# Altium schematic sheet Audio_Amplifier.SchDoc
size A4; SheetNumber: 1; SheetTotal: 1
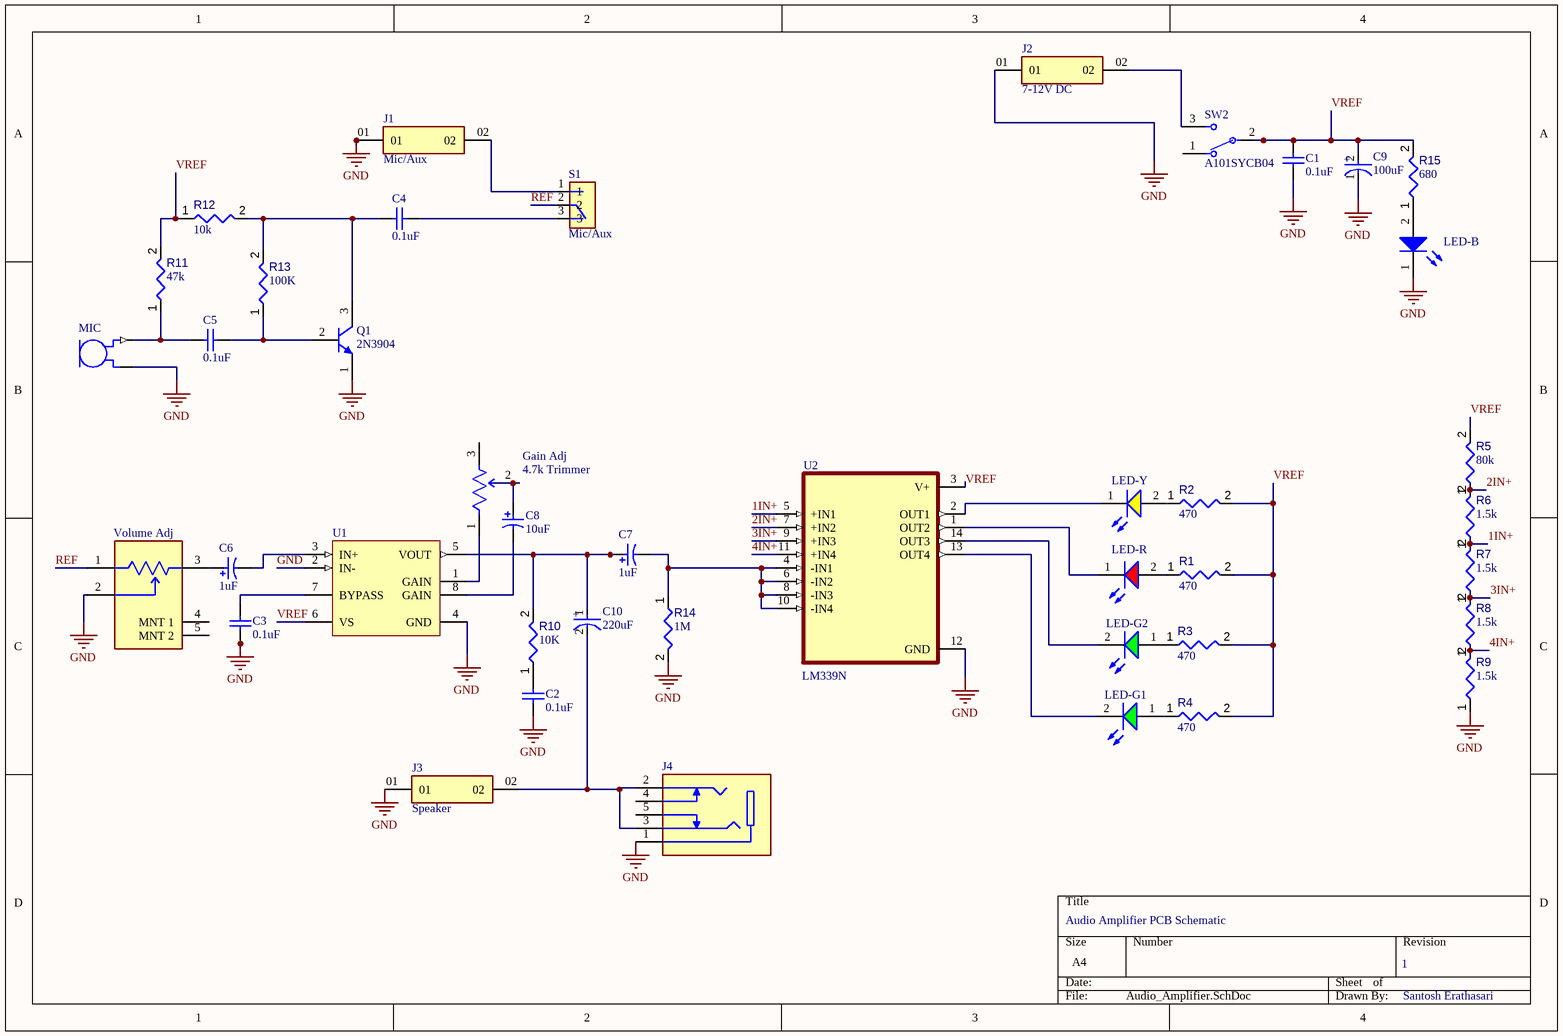
[diagram p0: Audio_Amplifier.SchDoc]

## Parts
C1  0.1uF  [CAPR51-254-508X318X736]
C2  0.1uF  [CAPR51-254-508X318X736]
C3  0.1uF  [CAPR51-254-508X318X736]
C4  0.1uF  [CAPR51-254-508X318X736]
C5  0.1uF  [CAPR51-254-508X318X736]
C6  1uF  [CAPPR55-200-1100X500X1200]
C7  1uF  [CAPPR55-200-1100X500X1200]
C8  10uF  [CAPPR55-200-1100X500X1200]
C9  100uF  [FP-RAD-TH-D_6_3_0_5-L_11-MFG]
C10  220uF  [FP-EEU-FC1V221L-MFG]
Gain_Adj  4.7k Trimmer  [FP-3362U-MFG]
J1  Mic/Aux  [SAMTEC_HTSW-101-08-T-D]
J2  7-12V DC  [SAMTEC_HTSW-101-08-T-D]
J3  Speaker  [SAMTEC_HTSW-101-08-T-D]
J4  SJ1-3525NG  [CUI_SJ1-3525NG]  (value not drawn)
LED-B  LED-B  [WL-TMRW_D5.8H11.7]  (value not drawn)
LED-G1  151051VS04000  [WL-TMRC_D5.9H8.7]  (value not drawn)
LED-G2  151051VS04000  [WL-TMRC_D5.9H8.7]  (value not drawn)
LED-R  151053RS03000  [WL-TMRW_D5.8H11.7]  (value not drawn)
LED-Y  LED-Y  [WL-TMRW_D5.8H11.7]  (value not drawn)
MIC  CMA-6542PF  [CUI_CMA-6542PF]  (value not drawn)
Q1  2N3904  [ONSC-TO-92-3-29-11]
R1  value 470  [RESA60-630X240]  (hidden comment: MFR-25FBF52-10K)
R2  value 470  [RESA60-630X240]  (hidden comment: MFR-25FBF52-10K)
R3  value 470  [RESA60-630X240]  (hidden comment: MFR-25FBF52-10K)
R4  value 470  [RESA60-630X240]  (hidden comment: MFR-25FBF52-10K)
R5  value 80k  [RESA60-630X240]  (hidden comment: MFR-25FBF52-10K)
R6  value 1.5k  [RESA60-630X240]  (hidden comment: MFR-25FBF52-10K)
R7  value 1.5k  [RESA60-630X240]  (hidden comment: MFR-25FBF52-10K)
R8  value 1.5k  [RESA60-630X240]  (hidden comment: MFR-25FBF52-10K)
R9  value 1.5k  [RESA60-630X240]  (hidden comment: MFR-25FBF52-10K)
R10  value 10K  [RESA60-630X240]  (hidden comment: MFR-25FBF52-10K)
R11  value 47k  [RESA60-630X240]  (hidden comment: MFR-25FBF52-10K)
R12  value 10k  [RESA60-630X240]  (hidden comment: MFR-25FBF52-10K)
R13  value 100K  [RESA60-630X240]  (hidden comment: MFR-25FBF52-10K)
R14  value 1M  [RESA60-630X240]  (hidden comment: MFR-25FBF52-10K)
R15  value 680  [RESA60-630X240]  (hidden comment: MFR-25FBF52-10K)
S1  Mic/Aux  [SW_OS102011MS2QN1]
SW2  A101SYCB04  [FP-A101SYCB04-MFG]
U1  LM386N-1  [P0008A]  (value not drawn)
U2  LM339N  [DIP794W45P254L1969H508Q14]
Volume_Adj  PTV09A-8025U-B103  [FP-PTV09-8-MFG]  (value not drawn)

## Nets
GND: C1.2 C2.1 C3.1 C9.1(C) J1.01 J2.01 J3.01 J4.1 LED-B.1(K) MIC.GND Q1.1(E) R9.1 R14.2 U1.2(IN-) U1.4(GND) U2.12(GND) Volume_Adj.2
1IN+: R6.1 R7.2 U2.5(+IN1)
2IN+: R5.1 R6.2 U2.7(+IN2)
3IN+: R7.1 R8.2 U2.9(+IN3)
4IN+: R8.1 R9.2 U2.11(+IN4)
REF: S1.2 Volume_Adj.1
VREF: C1.1 C9.2(A) R1.2 R2.2 R3.2 R4.2 R5.2 R11.2 R12.1 R15.2 SW2.2 U1.6(VS) U2.3(V+)
NetC2_2: C2.2 R10.1
NetC3_2: C3.2 U1.7(BYPASS)
NetC4_1: C4.1 Q1.3(C) R12.2 R13.2
NetC4_2: C4.2 S1.3
NetC5_1: C5.1 MIC.OUT R11.1
NetC5_2: C5.2 Q1.2(B) R13.1
NetC6_1: C6.1 Volume_Adj.3
NetC6_2: C6.2 U1.3(IN+)
NetC7_1: C7.1 C10.1(C) R10.2 U1.5(VOUT)
NetC7_2: C7.2 R14.1 U2.4(-IN1) U2.6(-IN2) U2.8(-IN3) U2.10(-IN4)
NetC8_1: C8.1 Gain_Adj.2(WIPER)
NetC8_2: C8.2 U1.8(GAIN)
NetC10_2: C10.2(A) J3.02 J4.2 J4.3
NetGain_Adj_1: Gain_Adj.1(CCW) U1.1(GAIN)
NetJ1_02: J1.02 S1.1
NetJ2_02: J2.02 SW2.3
NetLED-B_2: LED-B.2(A) R15.1
NetLED-G1_1: LED-G1.1(A) R4.1
NetLED-G1_2: LED-G1.2(K) U2.13(OUT4)
NetLED-G2_1: LED-G2.1(A) R3.1
NetLED-G2_2: LED-G2.2(K) U2.14(OUT3)
NetLED-R_1: LED-R.1(K) U2.1(OUT2)
NetLED-R_2: LED-R.2(A) R1.1
NetLED-Y_1: LED-Y.1(K) U2.2(OUT1)
NetLED-Y_2: LED-Y.2(A) R2.1

Not connected (* = marked no-connect by the designer): Gain_Adj 3(CW); J4 4 5; SW2 1; Volume_Adj 4(MNT_1) 5(MNT_2)

## Notes on the sheet
- Audio Amplifier PCB Schematic
- 1
- Santosh Erathasari
- (in symbol CMP-05427-000010-1) +
- (in symbol CMP-05427-001480-1) +

## Library data of the parts
C1-C5 = CMP-1664-00004-1: Radial Leaded Multilayer Ceramic Capacitor, 0.1 uF, +/- 10%, 50 V, -55 to 125 degC, 2-Pin THD, RoHS, Tape and Reel; Case\Package: SOT-23-5; Max Power Dissipation: 250 mW; Output Current: 150 mA; Dropout Voltage: 260 mV; Outputs: 1; Output Voltage: 5 V; Max Input Voltage: 8 V; Min Operating Temperature: -40 degC; Packaging: Tape and Reel; Height: 1.3 mm; Radiation Hardening: No; Pins: 5; ComponentLink1Description: Manufacturer URL; Mount: Surface Mount; RoHSCompliant: true; Max Operating Temperature: 85 degC; PackageReference: CAPR51-254-508X318X736; ComponentLink2URL: http://www.kemet.com/docfinder?Partnumber=C320C104K5R5TA; PackageDescription: 2-Pin Through Hole Device, Body 5.08 x 3.18 mm, Pitch 2.54 mm; ComponentLink1URL: http://www.kemet.com/; Width: 1.8 mm; Package Quantity: 3000; DatasheetVersion: Dec-15; Length: 3 mm; ComponentLink2Description: Datasheet
C6 C7 = CMP-1665-00039-1: Aluminum Electrolytic Capacitor, 1 uF, +/- 20%, 50 V, -55 to 105 degC, 2-Pin THD, RoHS, Bulk; Channels: 2; ComponentLink1Description: Manufacturer URL; ComponentLink2Description: Datasheet; ComponentLink2URL: https://datasheet.ciiva.com/7275/94060-7275472.pdf; PackageDescription: 2-Pin Radial Lead, Dia 5 mm, Body Length 11 mm; PackageReference: CAPPR55-200-1100X500X1200; Mount: Through Hole; Radiation Hardening: No; ComponentLink1URL: http://www.panasonic.com/; Min Operating Temperature: -30 degC; Package Quantity: 150; Max Operating Temperature: 70 degC; DatasheetVersion: Mar-05; RoHSCompliant: true; Packaging: Bulk
C8 = CMP-1665-00038-2: Aluminum Electrolytic Capacitor, 10 uF, +/- 20%, 50 V, -40 to 85 degC, 2-Pin THD, RoHS, Bulk; Manufacturer: Panasonic; Life (Hours): 2000Hour; Lead/Base Style: Straight; Dissipation Factor: 0.12%; Leakage Current: 3uA; Dielectric Material: Aluminium; Lead Diameter: 0.5mm; Voltage Rating: 50V; Ripple Current: 65mA; Package Reference: CAPPR55-200-1100X500X1200; Height: 11mm; Diameter: 5mm; REACH SVHC: NoSVHC; Mount: ThroughHole; Packaging: Bulk; Manufacturer URL: http://www.panasonic.com/; Capacitance: 10uF; Termination: Radial; Datasheet URL: https://industrial.panasonic.com/cdbs/www-data/pdf/RDF0000/ABA0000C1218.pdf; Lead Free: LeadFree; Height - Seated (Max): 0.472inch; Case/Package: Radial; Package Description: 2-Pin Radial Lead, Dia 5 mm, Height 12 mm; Tolerance: 20%; Datasheet Version: Rev. 05, 10/2016; Package Quantity: 200; Ripple Current (AC): 65mA; Min Operating Temperature: -40degC; RoHSCompliant: true; Number of Pins: 2; Max Operating Temperature: 85degC; Voltage: 50V; Lead Pitch: 2mm; Radiation Hardening: No; Voltage Rating (DC): 50V; Length: 11mm
C9 = CMP-05427-001480-1: Aluminum Electrolytic Capacitors (Radial Lead Type) 100uF ±20% 25V
C10 = CMP-05427-000010-1: CAP ALUM 220UF 20% 35V RADIAL; Manufacturer: Panasonic Electronic Components; Manufacturer Part Number: EEU-FC1V221L; Material: Aluminum; Leakage Current: 77uA; Esr: 0.085Ω; Life: 2000Hours; Automotive Grade: Grade 2; Dissipation Factor: 12%; Ripple Current: 730mA; Octopart: https://octopart.com/eeu-fc1v221l-panasonic-39478519; ComponentLink2URL: https://industrial.panasonic.com/cdbs/www-data/pdf/RDF0000/ABA0000C1209.pdf; Package: 0; Height: 16.5mm; Category: Cap; Value: 220uF; ComponentLink2Description: Datasheet; Lead Free: Yes; Device Class L2: Capacitors; Temperature Range High: +105°C; Mouser Description: Capacitor; Aluminum Electrolytic; Fc Radial Elec Cap 220uF 35V; Temperature: -55°C to +105°C; Digikey Description: CAP ALUM 220UF 20% 35V RADIAL; Device Class L3: Aluminum Electrolytic Capacitors; Device Class L1: Passive Components; Automotive: Yes; RoHS: TRUE; Temperature Range Low: -55°C; Capacitance: 220uF; Voltage Rating: 35V; Tolerance: 20%
Gain_Adj = CMP-07234-000033-1: TRIMMER 200K OHM 0.5W PC PIN TOP; Max Power Dissipation: 500mW; Temperature Coefficient: 100ppm/°C; Tolerance: 10%; Voltage Rating (DC): 300V; Resistance: 200kR; Package Quantity: 50; Length: 6.6mm; Lead Free: Lead Free; Technology: CERMET; RoHS Compliant: Yes; Max Operating Temperature: 125°C; Military Standard: Not; Packaging: Rail/Tube; Depth: 6.99mm; Mount: Through Hole; Termination: Pin; Color: Blue; Width: 0.26inch; Height: 0.185inch; Taper: Linear; Min Operating Temperature: -55°C; Weight: 0.02oz; Power Rating: 500mW; Series: Trimpot® 3362 - Sealed; Contact Plating: Tin; Resistor Type: Cermet
J1-J3 = HTSW-101-08-T-D: MP: HTSW-101-08-T-D; Price: None; Package: None; Value: *; Availability: Unavailable
J4 = CMP-002-00071-1: 3.5 mm Right-Angle Stereo Jack, 5 Pin PCB Mount, Isolated Ground; Price: None; Value: *; Case/Package: None; MP: SJ1-3525NG; Design Item ID: SJ1-3525NG; Source: SJ1-3525NG.SchLib; Availability: Unavailable
LED-B = CMP-1489-00006-2: NexarPartId: 29717816; Peak Wavelength: 461nm; Luminous Intensity: 2cd; Dominant Wavelength: 465nm; Test Current: 20mA; Lens Style: Circular, Clear, Round; Forward Voltage: 2.7V; Forward Current: 100mA; Viewing Angle: 45°; Lens Size: 5mm; Max Reverse Voltage (DC): 5V; Max Operating Temperature: 85°C; Wavelength: 465nm; REACH SVHC: Unknown; Height: 8.6mm; Min Operating Temperature: -40°C; Width: 5mm; RoHS: Compliant; Mount: Through Hole; Length: 5mm; Case/Package: Radial; Packaging: Bulk; Color: Blue
LED-G1 LED-G2 = CMP-1488-00007-2: NexarPartId: 29717814; Forward Voltage: 2.1V; Viewing Angle: 40°; Lens Size: 5mm; Luminous Intensity: 140mcd; Max Reverse Voltage (DC): 5V; Wavelength: 572nm; Forward Current: 100mA; Peak Wavelength: 573nm; Test Current: 20mA; Lens Style: Circular, Diffused, Round; Color: Green; REACH SVHC: Unknown; Height: 8.6mm; Mount: Through Hole; Width: 5mm; Length: 5mm; Min Operating Temperature: -40°C; RoHS: Compliant; Dominant Wavelength: 572nm; Case/Package: Radial; Max Operating Temperature: 85°C; Packaging: Bulk
LED-R = CMP-1489-00007-2: NexarPartId: 29717818; Viewing Angle: 30°; Test Current: 20mA; Forward Voltage: 1.9V; Lens Size: 5mm; Wavelength: 623nm; Lens Style: Circular, Clear, Round; Luminous Intensity: 5cd; Peak Wavelength: 631nm; Max Reverse Voltage (DC): 5V; Forward Current: 100mA; Height: 8.6mm; Packaging: Bulk; Length: 5mm; Dominant Wavelength: 623nm; RoHS: Compliant; Mount: Through Hole; Max Operating Temperature: 85°C; Width: 5mm; Case/Package: Radial; Min Operating Temperature: -40°C; REACH SVHC: Unknown; Color: Red
LED-Y = CMP-1477-00001-2: NexarPartId: 29717819; Peak Wavelength: 592nm; Dominant Wavelength: 590nm; Viewing Angle: 45°; Luminous Intensity: 1.5cd; Lens Style: Circular, Clear, Round; Forward Current: 100mA; Lens Size: 5mm; Test Current: 20mA; Forward Voltage: 2.1V; Max Reverse Voltage (DC): 5V; REACH SVHC: Unknown; Max Operating Temperature: 85°C; Packaging: Bulk; Case/Package: Radial; Length: 5mm; Width: 5mm; Color: Yellow; Mount: Through Hole; Min Operating Temperature: -40°C; Height: 8.6mm; RoHS: Compliant; Wavelength: 590nm
MIC = CMP-011-000000-1: 9.7 mm, Omnidirectional, PCB Mount, 4.5 Vdc, Electret Condenser Microphone; MF: CUI Devices; Purchase-URL: https://pricing.snapeda.com/search/part/CMA-6542PF/?ref=eda; Check_prices: https://www.snapeda.com/parts/CMA-6542PF/CUI+Devices/view-part/?ref=eda; Pin Count: 2; Source: CMA-6542PF.SchLib; Design Item ID: CMA-6542PF; Value: *; CUI_purchase_URL: https://www.cuidevices.com/product/audio/microphones/electret-condenser-microphones/cma-6542pf?utm_source=snapeda.com&utm_medium=referral&utm_campaign=snapedaBOM; Price: None; Availability: In Stock; Package: None; MP: CMA-6542PF; SnapEDA_Link: https://www.snapeda.com/parts/CMA-6542PF/CUI+Devices/view-part/?ref=snap; Component Type: Standard
Q1 = CMP-2000-05562-1: General Purpose Transistor, NPN Silicon, 200 mA, 60 V, -55 to 150 degC, 3-Pin TO-92, RoHS, Bulk; Manufacturer: ONSemiconductor; Emitter- Base Voltage VEBO: 6V; Maximum Power Dissipation: 625mW; Maximum DC Collector Current: 0.2A; Collector- Emitter Voltage VCEO Max: 40V; Collector- Base Voltage VCBO: 60V; DC Collector/Base Gain hfe Min: 60; Configuration: Single; Collector-Emitter Saturation Voltage: 0.3V; Gain Bandwidth Product fT: 270MHz; Mounting Style: ThroughHole; Package / Case: TO-92-3(TO-226); Mounting Technology: ThroughHole; Minimum Operating Temperature: -65C; Datasheet Version: Rev. 8, 08/2012; Product Category: BipolarTransistors-BJT; Factory Pack Quantity: 5000; Transistor Polarity: NPN; Package Description: 3-Pin Transistor Outline, Body 4.825 x 3.685 mm, Pitch 1.27 mm; RoHS: Details; Datasheet URL: https://datasheet.ciiva.com/4725/2n3903-d-285841-4725808.pdf; Packaging: Bulk; Maximum Operating Temperature: +150C; Package Reference: TO-92-3-29-11; Brand: ONSemiconductor; Manufacturer URL: http://www.onsemi.com/
R1-R15 = CMP-009-00047-4: Axial Resistor, 10 KOhm, +/- 1%, 0.25 W, -55 to 155 degC, 2-Pin THD, RoHS, Bulk; Manufacturer: Yageo; Power: 250mW; Voltage Rating: 250V; Manufacturer URL: http://www.yageo.com/; Datasheet URL: http://www.yageo.com/documents/recent/Yageo%20LR_MFR_2013.pdf; Package Reference: MFR-25; Min Operating Temperature: -55°C; Mounting Technology: TH; Package Quantity: 200; Case/Package: Axial; Tolerance: 1%; RoHS Compliant: True; Datasheet Version: Apr-13; Packaging: Bulk; Max Operating Temperature: 155°C; Package Description: 2-Pin Axial Lead, Dia 2.4 mm, Body Length 6.3 mm
S1 = OS102011MS2QN1: SLIDE SWITCH SPDT T/H ON-ON BBM; MF: C&K; SnapEDA_Link: https://www.snapeda.com/parts/OS102011MS2QN1/C%2526K/view-part/?ref=snap; Purchase-URL: https://pricing.snapeda.com/search/part/OS102011MS2QN1/?ref=eda; MP: OS102011MS2QN1; Value: *; Digi-Key_Part_Number: CKN9565-ND; Check_prices: https://www.snapeda.com/parts/OS102011MS2QN1/C%2526K/view-part/?ref=eda; Package: None
SW2 = CMP-03408-000017-1: SWITCH TOGGLE SPDT 0.4VA 20V; Electrical Life: 6000Cycles; Number of Poles: 1; Power Rating: 400mW; Switch Function: On-On; Contact Resistance: 10mR; Contact Current Rating: 400mA; Actuator Material: Phenolic; Insulation Resistance: 30MR; Actuator Color: Chrome; Number of Positions: 2; Actuator Type: Standard Round; Actuator Length: 10.41mm; Illumination Type: Non-Illuminated; Flammability Rating: UL94 V-1; Contact Material: Copper; Depth: 6.86mm; Contact Plating: Gold; Voltage Rating (AC): 20V; Max Voltage Rating (DC): 20V; Min Operating Temperature: -30°C; Max Operating Temperature: 85°C; Throw Configuration: SPDT; Packaging: Bulk; Termination: PC Pins; Series: Gemini A; ELV: Compliant; Lead Free: Lead Free; RoHS Compliant: Yes; REACH SVHC: No SVHC; Mount: Panel; Orientation: Straight; Package Quantity: 100; Max Voltage Rating (AC): 20V; Radiation Hardening: No; Voltage Rating (DC): 20V
U1 = CMP-0057-00052-4: Low Voltage Audio Power Amplifier, 8-pin MDIP, Pb-Free; Manufacturer: Texas Instruments; PackageTopMarking: NSUZXYTTE#*LM*386N-1; PowerWise: N; CompType: Audio IC; RoHS: Y; PackageReference: P0008A; Code_JEDEC: MS-001-BA; PackageDescription: MDIP, .365 x .250 x .130in, 8 Lead, .100in Pitch; PinCount: 8; ComponentLink1URL: http://www.ti.com/general/docs/lit/getliterature.tsp?genericPartNumber=LM386&fileType=pdf; ComponentLink1Description: Datasheet URL
U2 = LM339N/NOPB: Low Power Low Offset Voltage Quad Comparator; MF: Texas Instruments; Package: PDIP-14 Texas Instruments; SnapEDA_Link: https://www.snapeda.com/parts/LM339N/NOPB/Texas+Instruments/view-part/?ref=snap; Value: *; MP: LM339N/NOPB; Check_prices: https://www.snapeda.com/parts/LM339N/NOPB/Texas+Instruments/view-part/?ref=eda; Availability: In Stock; Price: None; Purchase-URL: https://pricing.snapeda.com/search/part/LM339N/NOPB/?ref=eda
Volume_Adj = CMP-07234-000054-1: POT 10K OHM 1/20W CARBON LINEAR; Resistance: 10kR; Number of Turns: 1; Max Power Dissipation: 50mW; Tolerance: 20%; Mount: Through Hole; Taper: Linear; Termination: PC Pins; Resistor Type: Carbon; RoHS Compliant: Yes; Number of Gangs: 1; Series: Pro Audio PTV09